# EAGLE schematic ADS1299_power (EAGLE 8.3.1)
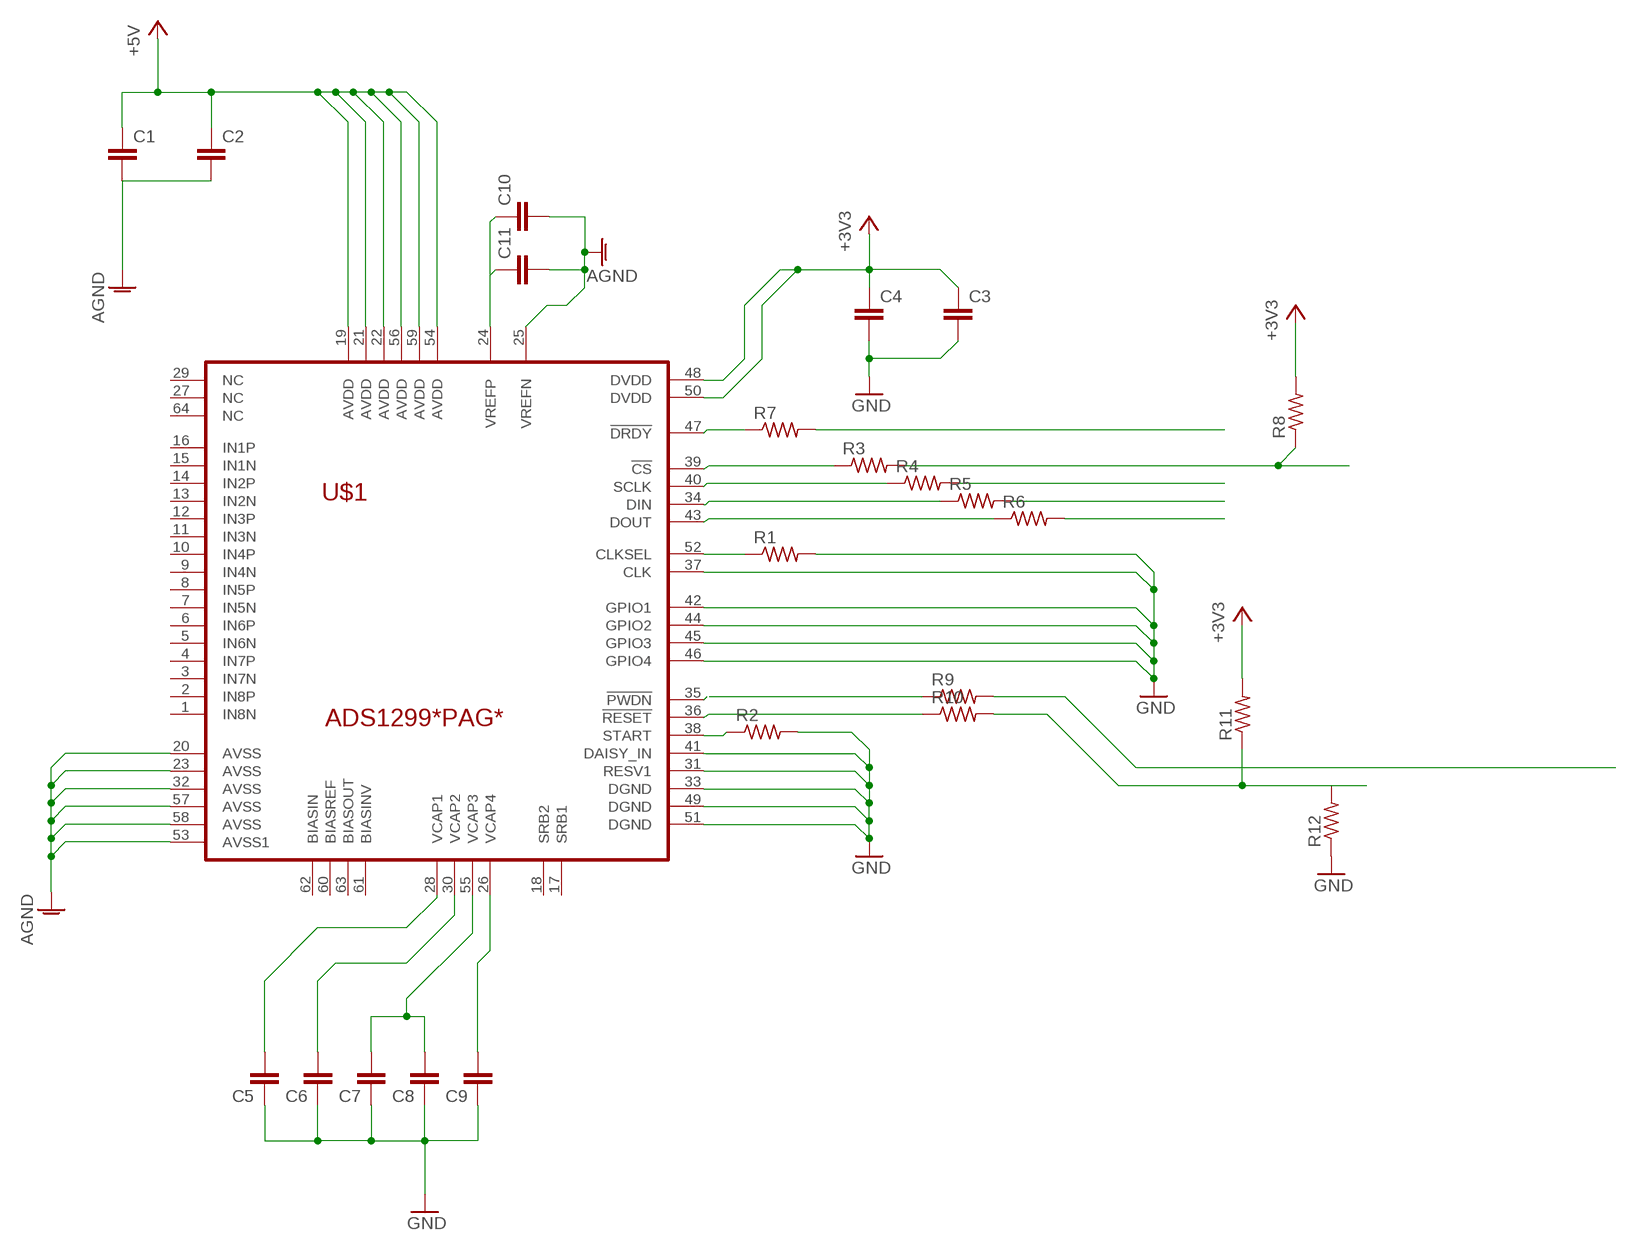
[diagram p0: schematic, sheet 1]

## Parts
C1  C2,5-3  [C2.5-3]
C2  C2,5-3  [C2.5-3]
C3  C2,5-3  [C2.5-3]
C4  C2,5-3  [C2.5-3]
C5  C2,5-3  [C2.5-3]
C6  C2,5-3  [C2.5-3]
C7  C2,5-3  [C2.5-3]
C8  C2,5-3  [C2.5-3]
C9  C2,5-3  [C2.5-3]
C10  C2,5-3  [C2.5-3]
C11  C2,5-3  [C2.5-3]
R1  R-US_0204/2V  [0204V]
R2  R-US_0204/2V  [0204V]
R3  R-US_0204/2V  [0204V]
R4  R-US_0204/2V  [0204V]
R5  R-US_0204/2V  [0204V]
R6  R-US_0204/2V  [0204V]
R7  R-US_0204/2V  [0204V]
R8  R-US_0204/2V  [0204V]
R9  R-US_0204/2V  [0204V]
R10  R-US_0204/2V  [0204V]
R11  R-US_0204/2V  [0204V]
R12  R-US_0204/2V  [0204V]
U$1  ADS1299*PAG*  [TQFP64]

## Nets
+3V3: C3.1 C4.1 R8.2 R11.2 U$1.48(DVDD) U$1.50(DVDD)
+5V: C1.1 C2.1 U$1.19(AVDD) U$1.21(AVDD) U$1.22(AVDD) U$1.54(AVDD) U$1.56(AVDD) U$1.59(AVDD)
AGND: C1.2 C2.2 C10.2 C11.2 U$1.20(AVSS) U$1.23(AVSS) U$1.25(VREFN) U$1.32(AVSS) U$1.53(AVSS1) U$1.57(AVSS) U$1.58(AVSS)
GND: C3.2 C4.2 C5.1 C6.1 C7.1 C8.1 C9.1 R1.2 R2.2 U$1.31(RESV1) U$1.33(DGND) U$1.37(CLK) U$1.41(DAISY_IN) U$1.42(GPIO1) U$1.44(GPIO2) U$1.45(GPIO3) U$1.46(GPIO4) U$1.49(DGND) U$1.51(DGND)
N$1: C9.2 U$1.26(VCAP4)
N$2: C7.2 C8.2 U$1.55(VCAP3)
N$3: C10.1 U$1.24(VREFP)
N$4: R1.1 U$1.52(CLKSEL)
N$6: C5.2 U$1.28(VCAP1)
N$7: U$1.39(!CS)
N$8: R4.1 U$1.40(SCLK)
N$9: C6.2 U$1.30(VCAP2)
N$10: R2.1 U$1.38(START)
N$11: R5.1 U$1.34(DIN)
N$12: R6.1 U$1.43(DOUT)
N$13: R3.2 R8.1
N$14: R4.2
N$15: R5.2
N$16: R6.2
N$17: R7.1 U$1.47(!DRDY)
N$18: R7.2
N$19: R10.1 U$1.36(!RESET)
N$20: U$1.35(!PWDN)
N$21: R9.1
N$22: R10.2 R11.1
N$23: R9.2
Unconnected: C11.1 R3.1 R12.1 R12.2 U$1.1(IN8N) U$1.2(IN8P) U$1.3(IN7N) U$1.4(IN7P) U$1.5(IN6N) U$1.6(IN6P) U$1.7(IN5N) U$1.8(IN5P) U$1.9(IN4N) U$1.10(IN4P) U$1.11(IN3N) U$1.12(IN3P) U$1.13(IN2N) U$1.14(IN2P) U$1.15(IN1N) U$1.16(IN1P) U$1.17(SRB1) U$1.18(SRB2) U$1.27(NC) U$1.29(NC) U$1.60(BIASREF) U$1.61(BIASINV) U$1.62(BIASIN) U$1.63(BIASOUT) U$1.64(NC)

## Library data of the parts
C1-C11 = capacitor-wima:C: CAPACITOR naming: grid - package width
R1-R12 = resistor:R-US_: RESISTOR, American symbol
U$1 = ADS129x:ADS1299: 8-Channel, 24-Bit Analog-To-Digital Converter With Integrated EEG Front End. ADS1299 modifications by Adam Feuer (adam@adamfeuer.com) Based on ADS1298: Drawn 23.07.2011 by Tomasz Boleslaw CEDRO (http://www.tomek.cedro.info).